# EAGLE design main_c (EAGLE 5.11)
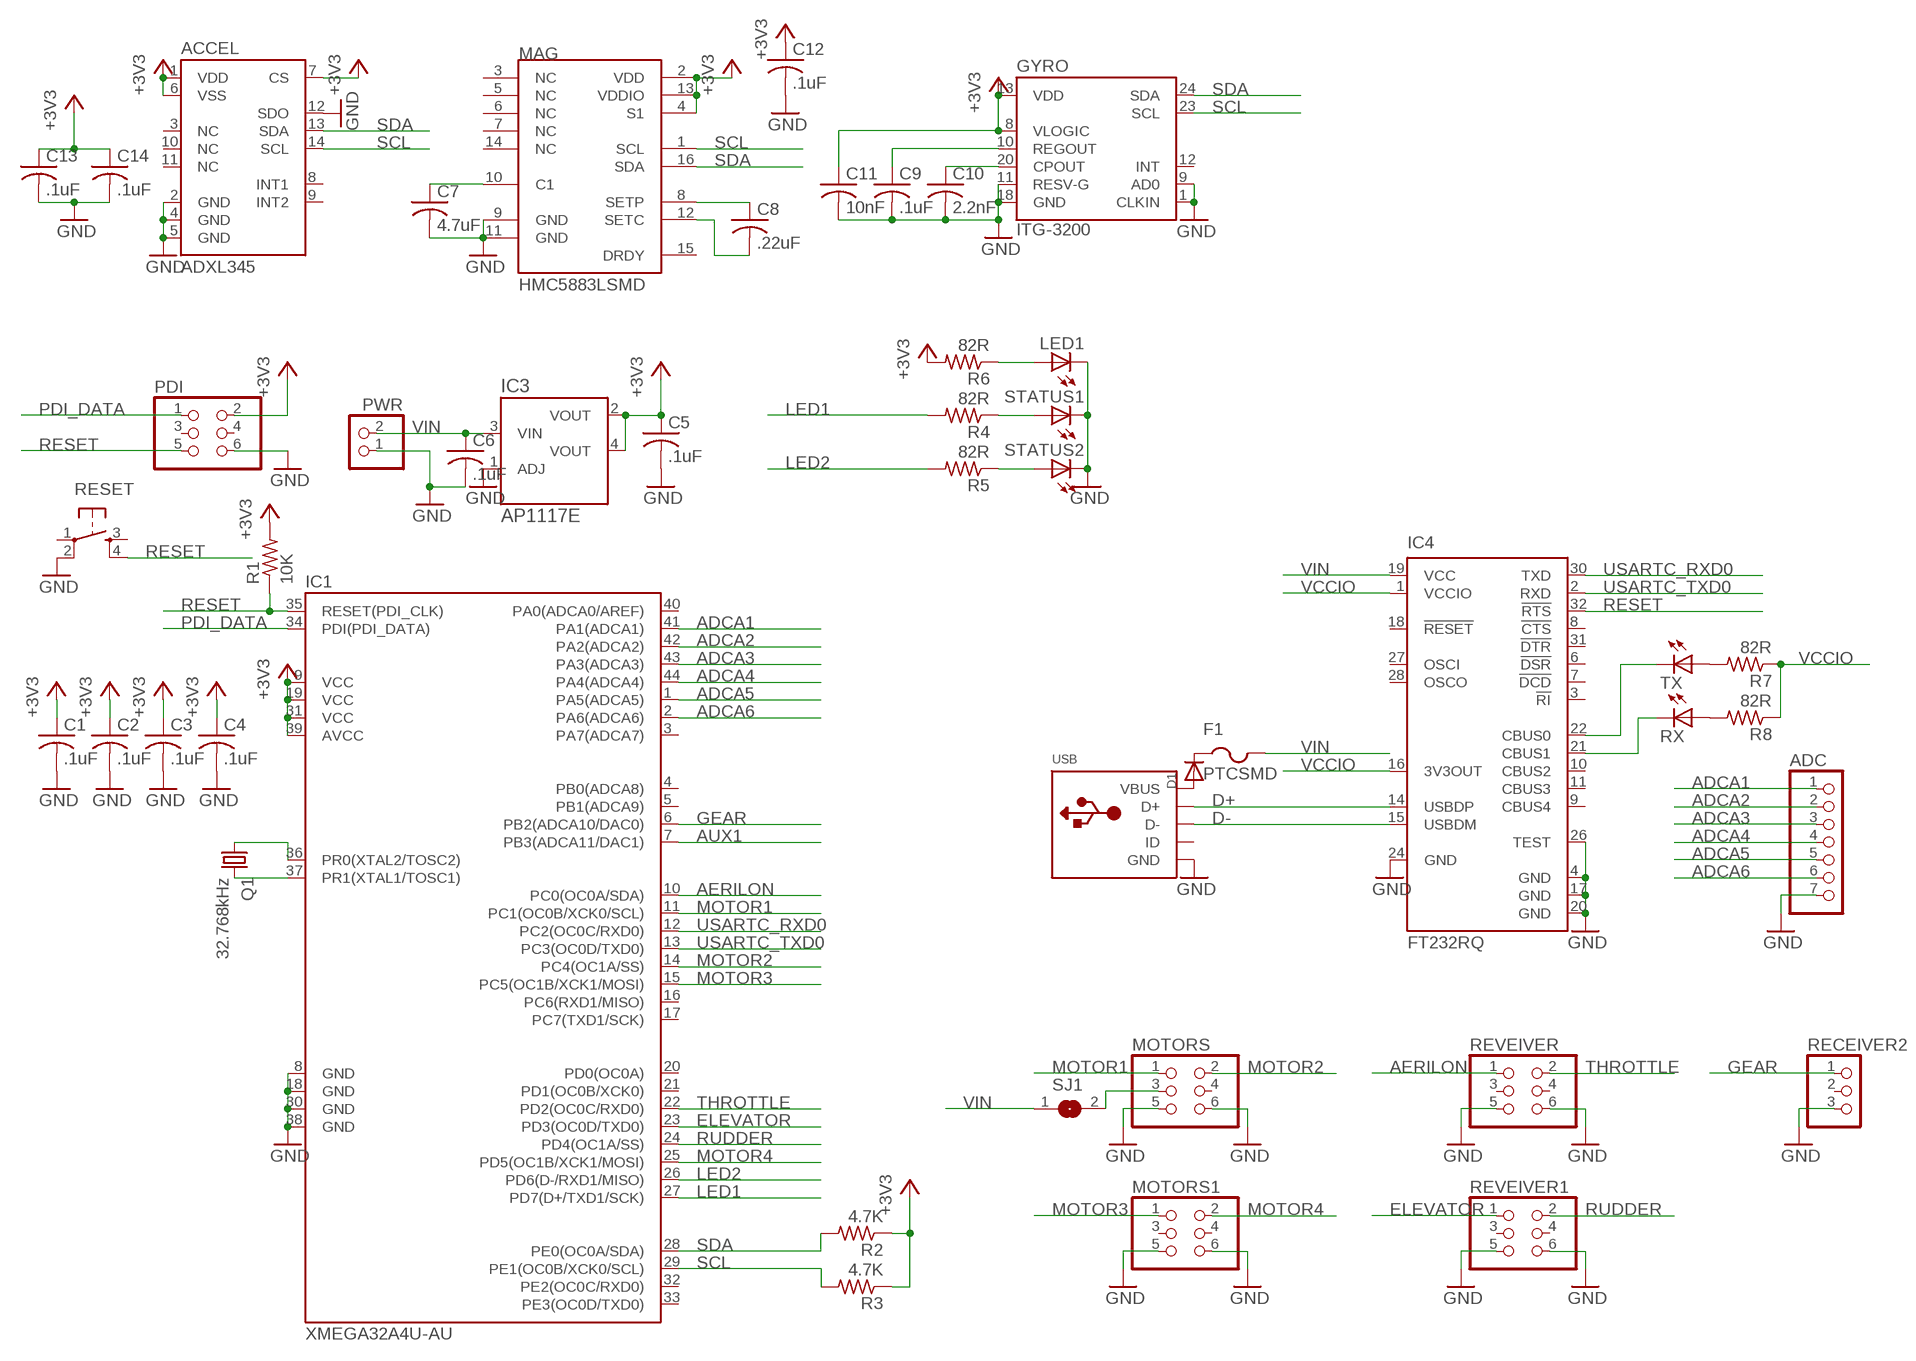
[diagram p0: schematic, sheet 1]

## Parts
ACCEL  ADXL345  [LGA14]
ADC  PINHD-1X7  [1X07]
C1  .1uF  C-USC0603  [C0603]
C2  .1uF  C-USC0603  [C0603]
C3  .1uF  C-USC0603  [C0603]
C4  .1uF  C-USC0603  [C0603]
C5  .1uF  C-USC0603  [C0603]
C6  .1uF  C-USC0603  [C0603]
C7  4.7uF  C-USC0805K  [C0805K]
C8  .22uF  C-USC0603  [C0603]
C9  .1uF  C-USC0603  [C0603]
C10  2.2nF  C-USC0603  [C0603]
C11  10nF  C-USC0603  [C0603]
C12  .1uF  C-USC0603  [C0603]
C13  .1uF  C-USC0603  [C0603]
C14  .1uF  C-USC0603  [C0603]
D1  DIODESOD-123  [SOD-123]
F1  PTCSMD  PTCFUSE-1812  [1812]
GYRO  ITG-3200  [QFN-24]
IC1  XMEGA32A4U-AU  [TQFP44]
IC3  AP1117E  [SOT223-3]
IC4  FT232RQ  [QFN32]
LED1  LEDCHIP-LED0805  [CHIP-LED0805]
MAG  HMC5883LSMD  [16LPCC]
MOTORS  PINHD-2X3  [2X03]
MOTORS1  PINHD-2X3  [2X03]
PDI  PINHD-2X3  [2X03]
PWR  JST_2PIN-THM  [JST-PH-2-THM]
Q1  32.768kHz  CRYSTALTC26V  [TC26V]
R1  10K  R-US_R0603  [R0603]
R2  4.7K  R-US_R0402  [R0402]
R3  4.7K  R-US_R0402  [R0402]
R4  82R  R-US_R0603  [R0603]
R5  82R  R-US_R0603  [R0603]
R6  82R  R-US_R0603  [R0603]
R7  82R  R-US_R0603  [R0603]
R8  82R  R-US_R0603  [R0603]
RECEIVER2  PINHD-1X3  [1X03]
RESET  TAC_SWITCHSMD  [TACTILE_SWITCH_SMD]
REVEIVER  PINHD-2X3  [2X03]
REVEIVER1  PINHD-2X3  [2X03]
RX  LEDCHIP-LED0805  [CHIP-LED0805]
SJ1  SJ  [SJ]
STATUS1  LEDCHIP-LED0805  [CHIP-LED0805]
STATUS2  LEDCHIP-LED0805  [CHIP-LED0805]
TX  LEDCHIP-LED0805  [CHIP-LED0805]
USB  USBMINIB  [USB-MINIB]

## Nets
+3V3: ACCEL.1(VDD) ACCEL.6(VSS) ACCEL.7(CS) C1.1 C2.1 C3.1 C4.1 C5.1 C11.1 C12.1 C13.1 C14.1 GYRO.8(VLOGIC) GYRO.13(VDD) IC1.9(VCC) IC1.19(VCC) IC1.31(VCC) IC1.39(AVCC) IC3.2(VOUT) IC3.4(VOUT) MAG.2(VDD) MAG.4(S1) MAG.13(VDDIO) PDI.2 R1.2 R2.1 R3.1 R6.2
ADCA1: ADC.1 IC1.41(PA1(ADCA1))
ADCA2: ADC.2 IC1.42(PA2(ADCA2))
ADCA3: ADC.3 IC1.43(PA3(ADCA3))
ADCA4: ADC.4 IC1.44(PA4(ADCA4))
ADCA5: ADC.5 IC1.1(PA5(ADCA5))
ADCA6: ADC.6 IC1.2(PA6(ADCA6))
AERILON: IC1.10(PC0(OC0A/SDA)) REVEIVER.1
AUX1: IC1.7(PB3(ADCA11/DAC1))
D+: IC4.14(USBDP) USB.D+
D-: IC4.15(USBDM) USB.D-
ELEVATOR: IC1.23(PD3(OC0D/TXD0)) REVEIVER1.1
GEAR: IC1.6(PB2(ADCA10/DAC0)) RECEIVER2.1
GND: ACCEL.2(GND) ACCEL.4(GND) ACCEL.5(GND) ACCEL.12(SDO) ADC.7 C1.2 C2.2 C3.2 C4.2 C5.2 C6.2 C7.2 C9.2 C10.2 C11.2 C12.2 C13.2 C14.2 GYRO.1(CLKIN) GYRO.9(AD0) GYRO.11(RESV-G) GYRO.18(GND) IC1.8(GND) IC1.18(GND) IC1.30(GND) IC1.38(GND) IC3.1(ADJ) IC4.4(GND) IC4.17(GND) IC4.20(GND) IC4.24(GND) IC4.26(TEST) LED1.C MAG.9(GND) MAG.11(GND) MOTORS1.5 MOTORS1.6 MOTORS.5 MOTORS.6 PDI.6 PWR.1 RECEIVER2.3 RESET.2 REVEIVER1.5 REVEIVER1.6 REVEIVER.5 REVEIVER.6 STATUS1.C STATUS2.C USB.GND
LED1: IC1.27(PD7(D+/TXD1/SCK)) R4.2
LED2: IC1.26(PD6(D-/RXD1/MISO)) R5.2
MOTOR1: IC1.11(PC1(OC0B/XCK0/SCL)) MOTORS.1
MOTOR2: IC1.14(PC4(OC1A/SS)) MOTORS.2
MOTOR3: IC1.15(PC5(OC1B/XCK1/MOSI)) MOTORS1.1
MOTOR4: IC1.25(PD5(OC1B/XCK1/MOSI)) MOTORS1.2
N$1: IC1.36(PR0(XTAL2/TOSC2)) Q1.1
N$2: IC1.37(PR1(XTAL1/TOSC1)) Q1.2
N$3: R4.1 STATUS1.A
N$4: R5.1 STATUS2.A
N$5: C10.1 GYRO.20(CPOUT)
N$6: C7.1 MAG.10(C1)
N$7: C8.1 MAG.8(SETP)
N$8: LED1.A R6.1
N$9: C8.2 MAG.12(SETC)
N$10: C9.1 GYRO.10(REGOUT)
N$11: IC4.22(CBUS0) TX.C
N$12: IC4.21(CBUS1) RX.C
N$13: R7.2 TX.A
N$14: D1.A USB.VBUS
N$15: R8.2 RX.A
N$16: D1.C F1.1
N$17: MOTORS.3 SJ1.2
PDI_DATA: IC1.34(PDI(PDI_DATA)) PDI.1
RESET: IC1.35(RESET(PDI_CLK)) IC4.32(!RTS) PDI.5 R1.1 RESET.4
RUDDER: IC1.24(PD4(OC1A/SS)) REVEIVER1.2
SCL: ACCEL.14(SCL) GYRO.23(SCL) IC1.29(PE1(OC0B/XCK0/SCL)) MAG.1(SCL) R3.2
SDA: ACCEL.13(SDA) GYRO.24(SDA) IC1.28(PE0(OC0A/SDA)) MAG.16(SDA) R2.2
THROTTLE: IC1.22(PD2(OC0C/RXD0)) REVEIVER.2
USARTC_RXD0: IC1.12(PC2(OC0C/RXD0)) IC4.30(TXD)
USARTC_TXD0: IC1.13(PC3(OC0D/TXD0)) IC4.2(RXD)
VCCIO: IC4.1(VCCIO) IC4.16(3V3OUT) R7.1 R8.1
VIN: C6.1 F1.2 IC3.3(VIN) IC4.19(VCC) PWR.2 SJ1.1
Unconnected: ACCEL.3(NC) ACCEL.8(INT1) ACCEL.9(INT2) ACCEL.10(NC) ACCEL.11(NC) GYRO.12(INT) IC1.3(PA7(ADCA7)) IC1.4(PB0(ADCA8)) IC1.5(PB1(ADCA9)) IC1.16(PC6(RXD1/MISO)) IC1.17(PC7(TXD1/SCK)) IC1.20(PD0(OC0A)) IC1.21(PD1(OC0B/XCK0)) IC1.32(PE2(OC0C/RXD0)) IC1.33(PE3(OC0D/TXD0)) IC1.40(PA0(ADCA0/AREF)) IC4.3(!RI) IC4.6(!DSR) IC4.7(!DCD) IC4.8(!CTS) IC4.9(CBUS4) IC4.10(CBUS2) IC4.11(CBUS3) IC4.18(!RESET) IC4.27(OSCI) IC4.28(OSCO) IC4.31(!DTR) MAG.3(NC) MAG.5(NC) MAG.6(NC) MAG.7(NC) MAG.14(NC) MAG.15(DRDY) MOTORS1.3 MOTORS1.4 MOTORS.4 PDI.3 PDI.4 RECEIVER2.2 RESET.1 RESET.3 REVEIVER1.3 REVEIVER1.4 REVEIVER.3 REVEIVER.4 USB.ID

## Library data of the parts
ACCEL = SparkFun:ADXL345
ADC = pinhead:PINHD-1X7: PIN HEADER
C1-C14 = adafruit:C-US: CAPACITOR, American symbol
D1 = adafruit:DIODE: Diode SMADIODE - SMA Surface Mount Package 20V 1A Schottky Diode Digikey: 641-1014-6-ND DO-1N4148 - Through Hole Small Current Diode SOD-123 20V 1 A (.5mV Vf) Schottky Diode - Digikey: MBRX120TPMSCT-ND SOD-323 10V 570mA (.38mV Vf, 3ns) Schottky Diode - Digikey: ZLLS410CT-ND SOD-523 30V 30mA Schottky Diode (RB751S-40TE61) - Digikey: RB751S-40TE61CT-ND SOT23-R/W - SOT23 Package (R = Solder Paste/Reflow Ovens, W = Hand-Soldering) BAT54Film 40V 300mA - Digikey: 497-7162-1-ND
F1 = adafruit:PTCFUSE: PTC fuses, resettable thermistors
GYRO = SparkFun:ITG-3200: ITG-3200 3-axis gyro, digital output, qfn24 package
IC1 = atmel:XMEGA32A4U: 8/16-bit Atmel XMEGA A4U Microcontroller Features High-performance, Low-power 8/16-bit AVR XMEGA Microcontroller Non-Volatile Program and Data Memories - 16 KB - 128 KB of In-System Self-Programmable Flash - 4 KB - 8 KB Boot Code Section with Independent Lock Bits - 1 KB - 2 KB EEPROM - 2 KB - 8 KB Internal SRAM Peripheral Features - Four-channel DMA Controller with support for external requests - Eight-channel Event System - Five 16-bit Timer/Counters Three Timer/Counters with 4 Output Compare or Input Capture channels Two Timer/Counters with 2 Output Compare or Input Capture channels High-Resolution Extensions on all Timer/Counters Advanced Waveform Extension on one Timer/Counter - One USB device interface USB 2.0 full speed (12Mbps) and low speed (1.5Mbps) device compliant 32 Endpoints with full configuration flexibility - Five USARTs IrDA Extension on one USART - Two Two-Wire Interfaces with dual address match (I2C and SMBus compatible) - Two SPIs (Serial Peripheral Interfaces) peripherals - AES and DES Crypto Engine - 16-bit Real Time Counter with Separate Oscillator - One Twelve-channel, 12-bit, 2 Msps Analog to Digital Converter - One Two-channel, 12-bit, 1 Msps Digital to Analog Converter - Two Analog Comparators with Window compare function - External Interrupts on all General Purpose I/O pins - Programmable Watchdog Timer with Separate On-chip Ultra Low Power Oscillator Special Microcontroller Features - Power-on Reset and Programmable Brown-out Detection - Internal and External Clock Options with PLL - Programmable Multi-level Interrupt Controller - Sleep Modes: Idle, Power-down, Standby, Power-save, Extended Standby - Advanced Programming, Test and Debugging Interfaces PDI (Program and Debug Interface) for programming, test and debugging I/O and Packages - 34 Programmable I/O Lines - 44 - lead TQFP - 44 - pad VQFN/QFN - 49 - ball VFBGA Operating Voltage - 1.6 - 3.6V Speed performance - 0 - 12 MHz @ 1.6 - 3.6V - 0 - 32 MHz @ 2.7 - 3.6V
IC3 = Diodes Inc:AP1117: AP1117 1A Low Dropout Positive Adjustable or Fixed-Mode Regualtor Source: AP1117 Datasheet <http://www.diodes.com/datasheets/AP1117.pdf>
IC4 = ftdichip:FT232R: Source: http://www.ftdichip.com/Documents/DataSheets/DS_FT232R_v104.pdf; MPN: FT232RQ; OC_FARNELL: 1146033; OC_NEWARK: 91K9919
LED1 RX STATUS1 STATUS2 TX = adafruit:LED: LED OSRAM: - CHIPLED LG R971, LG N971, LY N971, LG Q971, LY Q971, LO R971, LY R971 LH N974, LH R974 LS Q976, LO Q976, LY Q976 LO Q996 - Hyper CHIPLED LW Q18S LB Q993, LB Q99A, LB R99A - SideLED LS A670, LO A670, LY A670, LG A670, LP A670 LB A673, LV A673, LT A673, LW A673 LH A674 LY A675 LS A676, LA A676, LO A676, LY A676, LW A676 LS A679, LY A679, LG A679 - Hyper Micro SIDELED® LS Y876, LA Y876, LO Y876, LY Y876 LT Y87S - SmartLED LW L88C, LW L88S LB L89C, LB L89S, LG L890 LS L89K, LO L89K, LY L89K LS L896, LA L896, LO L896, LY L896 - TOPLED LS T670, LO T670, LY T670, LG T670, LP T670 LSG T670, LSP T670, LSY T670, LOP T670, LYG T670 LG T671, LOG T671, LSG T671 LB T673, LV T673, LT T673, LW T673 LH T674 LS T676, LA T676, LO T676, LY T676, LB T676, LH T676, LSB T676, LW T676 LB T67C, LV T67C, LT T67C, LS T67K, LO T67K, LY T67K, LW E67C LS E67B, LA E67B, LO E67B, LY E67B, LB E67C, LV E67C, LT E67C LW T67C LS T679, LY T679, LG T679 LS T770, LO T770, LY T770, LG T770, LP T770 LB T773, LV T773, LT T773, LW T773 LH T774 LS E675, LA E675, LY E675, LS T675 LS T776, LA T776, LO T776, LY T776, LB T776 LHGB T686 LT T68C, LB T68C - Hyper Mini TOPLED® LB M676 - Mini TOPLED Santana® LG M470 LS M47K, LO M47K, LY M47K Source: http://www.osram.convergy.de/
MAG = SparkFun:HMC5883L: 3 Axis Digital Compass IC
MOTORS MOTORS1 PDI REVEIVER REVEIVER1 = pinhead:PINHD-2X3: PIN HEADER
PWR = adafruit:JST_2PIN: JST 2-Pin Connectors of various flavors SMT-RA (S2B-PH-SM4) 4UConnector #17311 SMT (B2B-PH-SM4) THM-RA (S2B-PH) THM (B2B-PH)
Q1 = crystal:CRYSTAL: CRYSTAL; OC_FARNELL: unknown; OC_NEWARK: unknown
R1-R8 = adafruit:R-US_: RESISTOR, American symbol
RECEIVER2 = pinhead:PINHD-1X3: PIN HEADER
RESET = SparkFun:TAC_SWITCH: Momentary Switch Button commonly used for reset or general input. Spark Fun Electronics SKU : COM-00097
SJ1 = jumper:SJ: SMD solder JUMPER
USB = icsp:USB: USB Connectors USBMINIB - Surface Mount Female Mini-B USB Connector 4UConnector: 06564 By microbuilder.eu Thru-hole RA Female Mini-B USB Connector 4UConnector: 18732 By ladyada.net

## Board
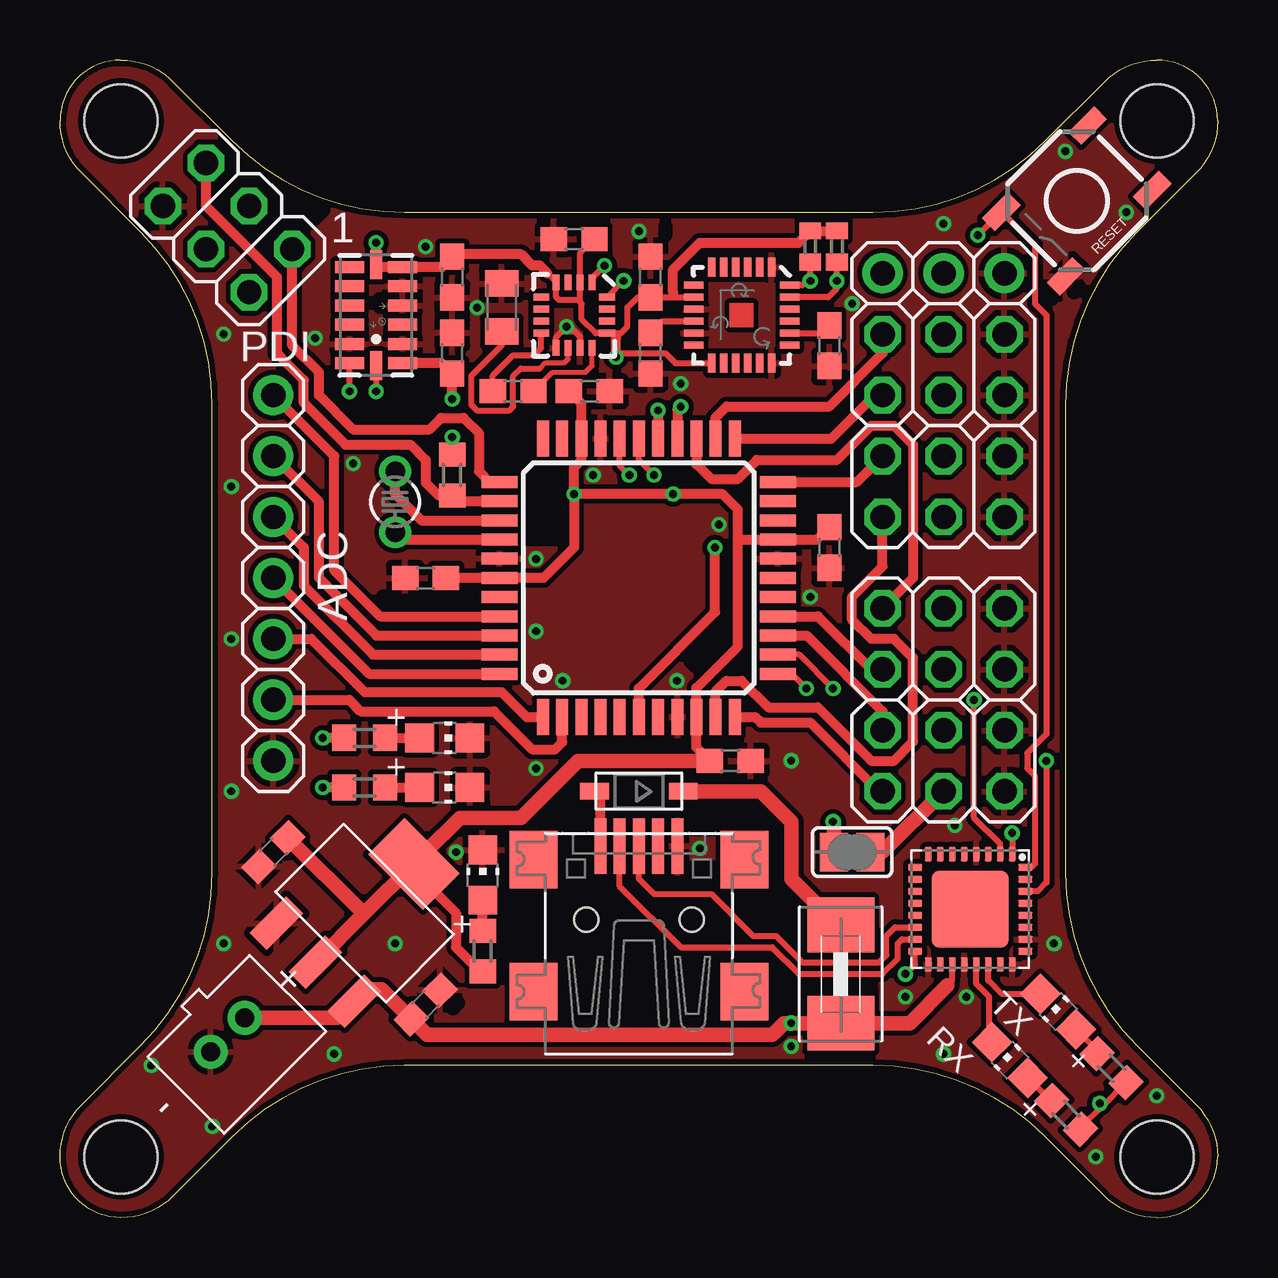
[diagram p1: board, top side]
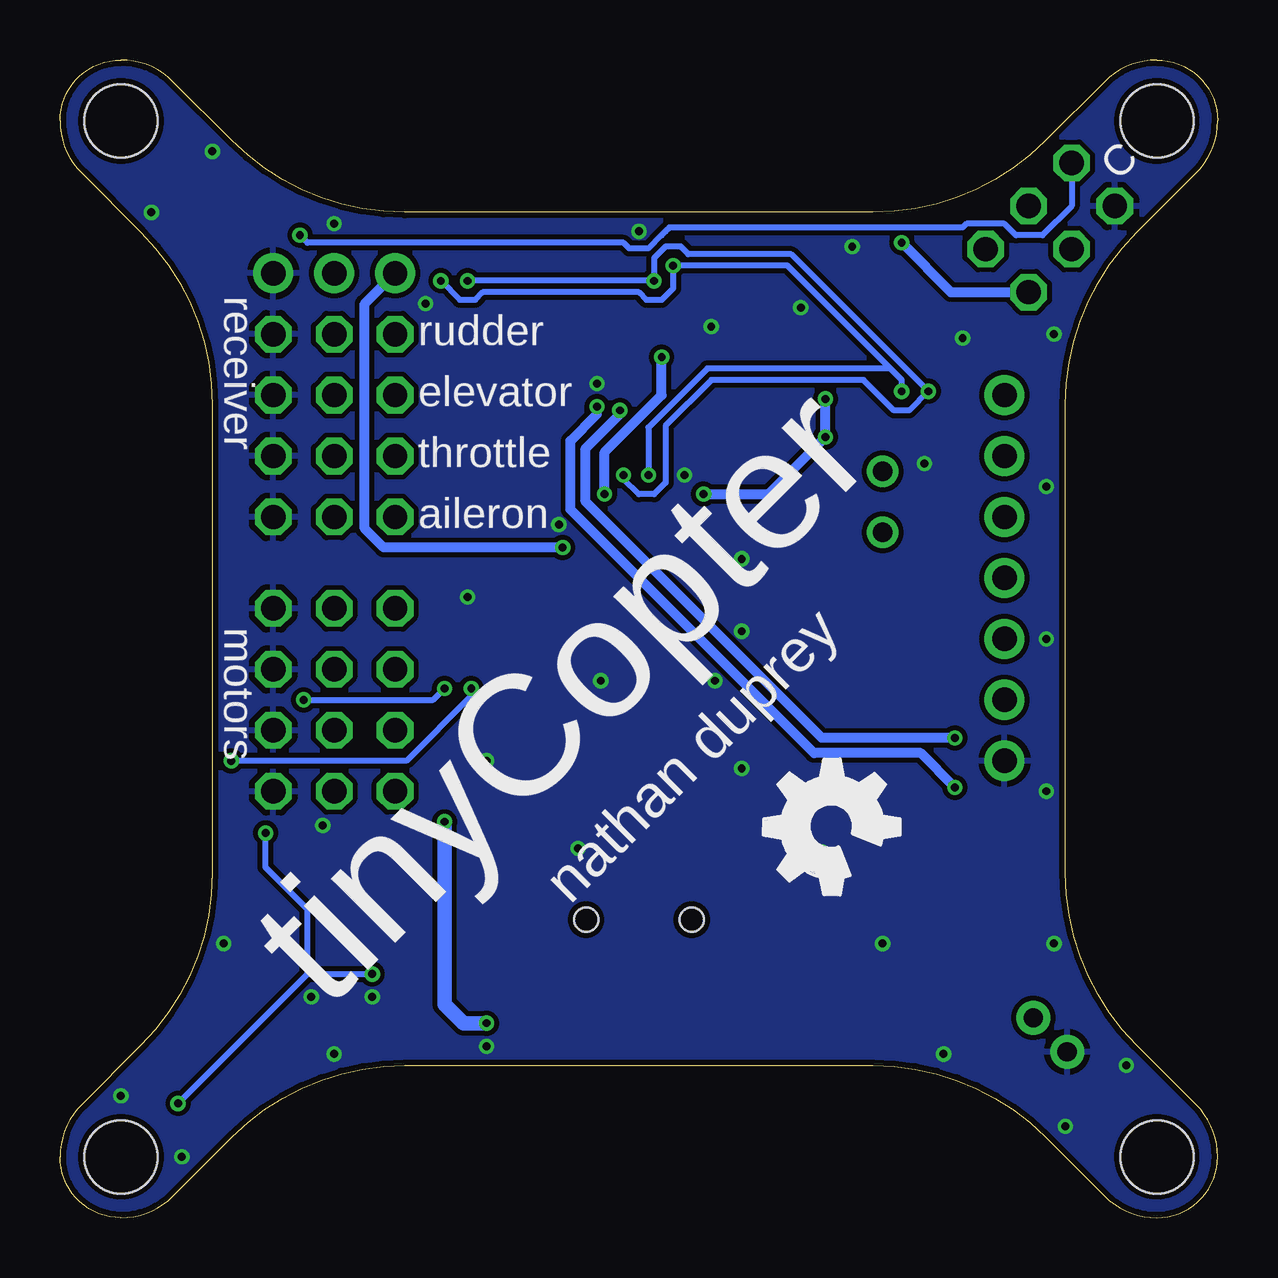
[diagram p2: board, bottom side, seen from below]

Size 48.26 x 48.26 mm. Coordinates in mm from the lower left corner, seen from the top.
Outline: 45.72,0 arc90 48.26,2.54 arc45 47.36,4.71 44.89,7.18 arc-45 41.91,14.37 41.91,33.89 arc-45 44.89,41.08 47.36,43.55 arc45 48.26,45.72 arc90 45.72,48.26 arc45 43.55,47.36 41.08,44.89 arc-45 33.89,41.91 14.37,41.91 arc-45 7.18,44.89 4.71,47.36 arc45 2.54,48.26 arc90 0,45.72 arc45 0.9,43.55 3.37,41.08 arc-45 6.35,33.89 6.35,14.37 arc-45 3.37,7.18 0.9,4.71 arc45 0,2.54 arc90 2.54,0 arc45 4.71,0.9 7.18,3.37 arc-45 14.37,6.35 33.89,6.35 arc-45 41.08,3.37 43.55,0.9 arc45 45.72,0
Copper layers (1*16): Top 0.035mm / dielectric 1.5mm / Bottom 0.035mm
Design rules "ITEADstudio_DRC": minimum track width 6mil, minimum drill 12mil, track to track 6mil, track to pad 6mil, pad to pad 6mil, via to via 6mil, smd to smd 0mil, copper to edge 10mil, drill to drill 10mil, minimum pad ring 10mil, minimum via ring 6mil, stop-mask expansion 2mil, vias tented up to drill 100mil, thermal gap 10mil
Holes 3.05 mm at 2.54,2.54 45.72,2.54 2.54,45.72 45.72,45.72
tRestrict: 23 lines

### Footprints (pad centres in the part's own frame; a part is rotated, then mirrored left to right if it is on the bottom)
LGA14 = smd 0.5 x 1.2: 1 2,1.1; 2 1.2,1.1; 3 0.4,1.1; 4 -0.4,1.1; 5 -1.2,1.1; 6 -2,1.1; 8 -2,-1.1; 9 -1.2,-1.1; 10 -0.4,-1.1; 11 0.4,-1.1; 12 1.2,-1.1; 13 2,-1.1 | smd 1.2 x 0.5: 7 -2.1,0; 14 2.1,0
1X07 = drill 1.016 pad 1.676 round: 1 -7.62,0; 2 -5.08,0; 3 -2.54,0; 4 0,0; 5 2.54,0; 6 5.08,0; 7 7.62,0
C0603 = smd 1.1 x 1: 1 -0.85,0; 2 0.85,0
C0805K = smd 1.1 x 1.4: 1 -1,0; 2 1,0
SOD-123 = smd 1.2 x 0.7: A 1.85,0; C -1.85,0
1812 = smd 2.286 x 2.794: 1 -2.046,0; 2 2.046,0
QFN-24 = smd 0.8 x 0.3: 1 -2,1.25; 2 -2,0.75; 3 -2,0.25; 4 -2,-0.25; 5 -2,-0.75; 6 -2,-1.25; 13 2,-1.25; 14 2,-0.75; 15 2,-0.25; 16 2,0.25; 17 2,0.75; 18 2,1.25 | smd 0.3 x 0.8: 7 -1.25,-2; 8 -0.75,-2; 9 -0.25,-2; 10 0.25,-2; 11 0.75,-2; 12 1.25,-2; 19 1.25,2; 20 0.75,2; 21 0.25,2; 22 -0.25,2; 23 -0.75,2; 24 -1.25,2
TQFP44 = smd 1.5 x 0.5: 1 -5.8,4; 2 -5.8,3.2; 3 -5.8,2.4; 4 -5.8,1.6; 5 -5.8,0.8; 6 -5.8,0; 7 -5.8,-0.8; 8 -5.8,-1.6; 9 -5.8,-2.4; 10 -5.8,-3.2; 11 -5.8,-4; 23 5.8,-4; 24 5.8,-3.2; 25 5.8,-2.4; 26 5.8,-1.6; 27 5.8,-0.8; 28 5.8,0; 29 5.8,0.8; 30 5.8,1.6; 31 5.8,2.4; 32 5.8,3.2; 33 5.8,4 | smd 0.5 x 1.5: 12 -4,-5.8; 13 -3.2,-5.8; 14 -2.4,-5.8; 15 -1.6,-5.8; 16 -0.8,-5.8; 17 0,-5.8; 18 0.8,-5.8; 19 1.6,-5.8; 20 2.4,-5.8; 21 3.2,-5.8; 22 4,-5.8; 34 4,5.8; 35 3.2,5.8; 36 2.4,5.8; 37 1.6,5.8; 38 0.8,5.8; 39 0,5.8; 40 -0.8,5.8; 41 -1.6,5.8; 42 -2.4,5.8; 43 -3.2,5.8; 44 -4,5.8
SOT223-3 = smd 1 x 2.15: 1 -2.3,-2.9; 2 0,-2.9; 3 2.3,-2.9 | smd 3.25 x 2.15: 4 0,2.9
QFN32 = smd 0.6 x 0.3: 1 -2.3,1.75; 2 -2.3,1.25; 3 -2.3,0.75; 4 -2.3,0.25; 5 -2.3,-0.25; 6 -2.3,-0.75; 7 -2.3,-1.25; 8 -2.3,-1.75; 17 2.3,-1.75; 18 2.3,-1.25; 19 2.3,-0.75; 20 2.3,-0.25; 21 2.3,0.25; 22 2.3,0.75; 23 2.3,1.25; 24 2.3,1.75 | smd 0.3 x 0.6: 9 -1.75,-2.3; 10 -1.25,-2.3; 11 -0.75,-2.3; 12 -0.25,-2.3; 13 0.25,-2.3; 14 0.75,-2.3; 15 1.25,-2.3; 16 1.75,-2.3; 25 1.75,2.3; 26 1.25,2.3; 27 0.75,2.3; 28 0.25,2.3; 29 -0.25,2.3; 30 -0.75,2.3; 31 -1.25,2.3; 32 -1.75,2.3 | smd 3.2 x 3.2: EXP 0,0
CHIP-LED0805 = smd 1.2 x 1.2: A 0,-1.05; C 0,1.05
16LPCC = smd 0.65 x 0.28: 1 -1.37,0.75; 2 -1.37,0.25; 3 -1.37,-0.25; 4 -1.37,-0.75; 9 1.37,-0.75; 10 1.37,-0.25; 11 1.37,0.25; 12 1.37,0.75 | smd 0.28 x 0.65: 5 -0.75,-1.37; 6 -0.25,-1.37; 7 0.25,-1.37; 8 0.75,-1.37; 13 0.75,1.37; 14 0.25,1.37; 15 -0.25,1.37; 16 -0.75,1.37
2X03 = drill 1.016 octagon: 1 -2.54,-1.27; 2 -2.54,1.27; 3 0,-1.27; 4 0,1.27; 5 2.54,-1.27; 6 2.54,1.27
JST-PH-2-THM = drill 0.8 pad 1.422 round: 1 1,0; 2 -1,0
TC26V = drill 0.813 round: 1 -1.27,0; 2 1.27,0
R0603 = smd 1 x 1.1: 1 -0.85,0; 2 0.85,0
R0402 = smd 0.7 x 0.9: 1 -0.65,0; 2 0.65,0
1X03 = drill 1.016 pad 1.676 round: 1 -2.54,0; 2 0,0; 3 2.54,0
TACTILE_SWITCH_SMD = smd 1.524 x 0.762: 1 -2.54,1.905; 2 2.54,1.905; 3 -2.54,-1.905; 4 2.54,-1.905
SJ = smd 1.168 x 1.6: 1 -0.762,0; 2 0.762,0
USB-MINIB = smd 0.5 x 2.308: D+ 0,4.064; D- -0.8,4.064; GND 1.6,4.064; ID 0.8,4.064; VBUS -1.6,4.064 | smd 2 x 2.4: GND1 -4.4,-2; GND2 -4.4,3.5; GND3 4.4,3.5; GND4 4.4,-2 | hole 1: -2.2,1; 2.2,1

### Placement (x,y rotation side)
ACCEL  13.18,37.62 270 top
ADC  8.89,26.67 270 top
C1  27.94,19.05 0 top
C2  32.07,27.94 270 top
C3  22.07,34.45 0 top
C4  15.24,26.67 180 top
C5  8.89,15.24 225 top
C6  15.24,8.89 45 top
C7  18.41,37.94 90 top
C8  18.89,34.45 0 top
C9  24.61,36.04 270 top
C10  32.07,36.35 270 top
C11  24.61,39.21 90 top
C12  21.43,40.8 180 top
C13  16.35,39.21 270 top
C14  16.35,36.04 90 top
D1  24.13,17.78 180 top
F1  32.54,10.16 270 top
GYRO  28.42,37.62 270 top
IC1  24.13,26.67 90 top
IC3  12.7,12.7 315 top
IC4  37.94,12.86 270 top
LED1  17.62,14.29 0 top
MAG  21.43,37.62 270 top
MOTORS  36.83,19.05 0 top
MOTORS1  36.83,24.13 0 top
PDI  6.99,41.27 135 top
PWR  6.99,7.62 225 top
Q1  13.97,29.84 270 top
R1  16.35,30.96 90 top
R2  31.27,40.48 270 top
R3  32.38,40.48 270 top
R4  12.7,20 180 top
R5  12.7,17.94 180 top
R6  17.62,11.11 270 top
R7  43.83,6.24 135 top
R8  41.94,4.29 135 top
RECEIVER2  36.83,39.37 0 top
RESET  42.39,42.39 225 top
REVEIVER  36.83,30.48 0 top
REVEIVER1  36.83,35.56 0 top
RX  39.59,6.57 45 top
SJ1  33.02,15.24 0 top
STATUS1  16.03,20 270 top
STATUS2  16.03,17.94 270 top
TX  41.61,8.59 45 top
U$1  [OSHW_FILLX200_NOTEXT]  16.51,12.7 45 bottom
USB  24.13,11.43 0 top

### Tracks (layer width: path | path; a pad name or v marks a point on that pad's centre or on a via)
+3V3  (via drill 0.33)
  Top 0.254: C12.1 21.68,40.2 MAG.2 21.68,38.17 | 21.75,38.1 21.75,37.47 22.34,36.87 MAG.13 23.18,36.87 | 21.75,38.1 21.68,38.17 | 21.75,38.1 | 21.68,38.17 21.59,38.26 20.8,38.26 20.68,38.37 MAG.4 20.68,39.01 20.32,39.37 | 25.56,38.37 24.62,38.37 C11.1 24.07,38.36 23.65,37.94 23.65,37.15 23.38,36.87 23.18,36.87 | 25.56,38.37 GYRO.8 | 25.56,38.37 25.56,38.58 | 23.18,36.67 23.18,36.87 | GYRO.13 25.65,35.62 25.24,36.04 23.34,36.04 v23.18,35.88
  Top 0.406: C13.1 15.91,39.62 ACCEL.6 13.28,39.62 ACCEL.7 v13.18,40.64 | ACCEL.1 15.91,35.62 C14.1 v16.35,34.13 | C2.1 31.55,28.27 IC1.19 28.27,28.27 28.26,28.26 | C1.1 26.53,19.61 IC1.9 26.53,22.09 28.26,23.81 28.26,27.78 28.26,28.26 | C4.1 IC1.39 20.16,26.67 21.43,27.94 v21.43,30.16 | 20.32,39.37 20,39.69 19.68,39.69 19.21,40.16 16.25,40.16 | IC3.4 14.75,14.46 16.51,12.7 16.51,11.27 17.52,10.26 R6.2 | v16.35,32.54 R1.2 | C3.1 21.73,33.94 IC1.31 21.73,31.57 21.43,31.27 v21.43,30.16 | R3.1 R2.1 30.78,40.64 26.67,40.64 25.56,39.53 25.56,38.58 | 28.26,28.26 28.26,29.53 27.62,30.16 v25.56,30.16 v21.43,30.16 | v23.18,35.88 23.18,36.67
  Top 0.61: IC3.2 12.7,12.7 | 12.7,12.7 IC3.4 | C5.1 12.63,12.7 12.7,12.7 | 16.25,40.16 C13.1 | 15.24,15.24 16.67,16.67 19.21,16.67 21.59,19.05 C1.1
  Top 0.813: IC3.4 15.24,15.24
  Bottom 0.406: v16.35,32.54 v16.35,34.13 | PDI.2 11.12,38.58 v13.18,40.64 | v23.18,35.88 23.18,34.29 25.56,31.91 v25.56,30.16 | v16.35,32.54 | v16.35,32.54 18.73,30.16 v21.43,30.16
ADCA1
  Top 0.406: IC1.41 13.35,25.07 11.43,26.99 11.43,31.75 ADC.1
ADCA2
  Top 0.406: IC1.42 13.2,24.27 10.79,26.67 10.79,29.84 ADC.2
ADCA3
  Top 0.406: IC1.43 13.04,23.47 10.16,26.35 10.16,27.94 ADC.3
ADCA4
  Top 0.406: IC1.44 12.89,22.67 ADC.4
ADCA5
  Top 0.406: ADC.5 10.48,24.13 12.7,21.91 18.41,21.91 19.45,20.87 IC1.1
ADCA6
  Top 0.406: ADC.6 12.06,21.59 12.54,21.11 18.1,21.11 19.68,19.53 20.64,19.53 20.93,19.82 IC1.2
AERILON
  Top 0.406: IC1.10 27.33,21.93 27.78,22.38 28.42,22.38 29.53,21.27 31.59,21.27 33.81,19.05 34.77,19.05 35.56,19.84 35.56,23.34 34.77,24.13 33.81,24.13 33.02,24.92 33.02,25.88 34.29,27.15 REVEIVER.1
D+
  Top 0.254: USB.D+ 24.13,14.13 24.77,13.49 27.15,13.49 28.89,11.75 29.84,11.75 30.96,10.64 34.13,10.64 34.45,10.95 34.45,11.75 34.81,12.11 IC4.14
D-
  Top 0.254: USB.D- 23.33,13.82 25.88,11.27 29.69,11.27 30.8,10.16 34.29,10.16 34.92,10.79 34.92,11.43 35.1,11.61 IC4.15
ELEVATOR
  Top 0.406: REVEIVER1.1 33.97,34.29 32.23,32.54 32.15,32.47 IC1.23
GEAR  (via drill 0.33)
  Top 0.406: IC1.6 24.13,22.07 27.3,25.24 v27.3,27.94
  Bottom 0.406: v27.3,27.94 34.77,27.94 35.56,28.73 35.56,38.1 RECEIVER2.1
GND  (via drill 0.33)
  Top 0.254: MAG.9 20.68,36.72 20.95,36.99 21.43,36.99 21.68,36.74 MAG.11
  other vias: 31.27,25.88 43.18,2.54 45.72,5.08 36.83,6.83 41.43,11.43 37.78,9.21 6.35,3.81 3.81,6.35 6.83,11.43 11.43,6.83 6.83,36.83 21.11,37.15 24.13,41.12 36.83,41.43 17.38,37.94 37.31,16.35 41.91,44.45 44.45,41.91 30.48,7.14 35.24,9.21 26.67,15.4 16.51,15.24 22.23,30.96 19.84,27.46 12.22,31.43 27.46,28.89 25.72,22.38 15.24,40.48 10.64,36.67 7.14,17.78 7.14,24.13 7.14,30.48 19.84,18.73 13.97,11.43 30.48,19.05 20.96,22.38 19.84,24.45 25.88,34.77 33.02,38.1
  pour Top (isolate 0.203): 7.18,3.37 arc-45 14.37,6.35 33.89,6.35 arc-45 41.08,3.37 43.55,0.9 arc45 45.72,0 arc90 48.26,2.54 arc45 47.36,4.71 44.89,7.18 arc-45 41.91,14.37 41.91,33.89 arc-45 44.89,41.08 47.36,43.55 arc45 48.26,45.72 arc90 45.72,48.26 arc45 43.55,47.36 41.08,44.89 arc-45 33.89,41.91 14.37,41.91 arc-45 7.18,44.89 4.71,47.36 arc45 2.54,48.26 arc90 0,45.72 arc45 0.9,43.55 3.37,41.08 arc-45 6.35,33.89 6.35,14.37 arc-45 3.37,7.18 0.9,4.71 arc45 0,2.54 arc90 2.54,0 arc45 4.71,0.9
  pour Bottom (isolate 0.203): 7.18,3.37 arc-45 14.37,6.35 33.89,6.35 arc-45 41.08,3.37 43.55,0.9 arc45 45.72,0 arc90 48.26,2.54 arc45 47.36,4.71 44.89,7.18 arc-45 41.91,14.37 41.91,33.89 arc-45 44.89,41.08 47.36,43.55 arc45 48.26,45.72 arc90 45.72,48.26 arc45 43.55,47.36 41.08,44.89 arc-45 33.89,41.91 14.37,41.91 arc-45 7.18,44.89 4.71,47.36 arc45 2.54,48.26 arc90 0,45.72 arc45 0.9,43.55 3.37,41.08 arc-45 6.35,33.89 6.35,14.37 arc-45 3.37,7.18 0.9,4.71 arc45 0,2.54 arc90 2.54,0 arc45 4.71,0.9
LED1  (via drill 0.33)
  Top 0.406: IC1.27 v24.93,33.65 v24.92,33.66 | R4.2 v10.95,20 | v10.95,20
  Bottom 0.406: v24.92,33.66 24.92,33.5 26.19,32.23 | 26.19,32.23 | 26.19,32.23 26.35,32.07 26.35,29.84 16.51,20 v10.95,20
LED2  (via drill 0.33)
  Top 0.406: IC1.26 25.73,33.67 v25.88,33.81 | R5.2 v10.95,17.94
  Bottom 0.406: v25.88,33.81 25.88,33.5 26.99,32.38 26.99,29.53 16.83,19.37 12.38,19.37 v10.95,17.94
MOTOR1
  Top 0.406: IC1.11 28.98,20.87 29.21,20.64 31.27,20.64 34.13,17.78 MOTORS.1
MOTOR2
  Top 0.406: IC1.14 31.13,24.27 34.29,21.11 MOTORS.2
MOTOR3
  Top 0.406: IC1.15 31.6,25.07 33.81,22.86 MOTORS1.1
MOTOR4
  Top 0.406: IC1.25 26.53,31.41 27.15,30.8 28.26,30.8 29.05,31.59 32.38,31.59 33.81,33.02 34.77,33.02 35.56,32.23 35.56,26.67 MOTORS1.2
N$1
  Top 0.406: IC1.36 15.06,29.07 13.97,30.16 Q1.1
N$2
  Top 0.406: IC1.37 14.28,28.27 Q1.2
N$3
  Top 0.406: R4.1 STATUS1.A | STATUS1.A
N$4
  Top 0.406: R5.1 STATUS2.A | STATUS2.A 15.08,17.94 15.24,17.78 15.14,17.78 STATUS2.A
N$5
  Top 0.254: GYRO.20 31.74,36.87 C10.1
N$6
  Top 0.203: MAG.10 21.18,35.79 21.03,35.64 20.24,35.64 20,35.4 | 17.22,33.81
  Top 0.254: 20,35.4 19.21,35.4 18.89,35.08 18.89,33.81 18.73,33.66 17.38,33.66 17.22,33.81 17.14,33.89 17.14,35.08 18.41,36.35 C7.1
N$7
  Top 0.254: MAG.8 20.06,36.25 19.76,35.96 18.89,35.96 18.04,35.11 C8.1
N$8
  Top 0.406: R6.1 LED1.A
N$9
  Top 0.203: MAG.12 22.18,35.52 21.91,35.24 20.54,35.24 C8.2
N$10
  Top 0.254: GYRO.10 25.09,37.37 C9.1
N$11
  Top 0.254: TX.C 39.24,9.33 38.69,9.89 IC4.22
N$12
  Top 0.254: IC4.21 38.19,9.75 38.73,9.21 38.73,7.43 RX.C
N$13
  Top 0.254: R7.2 43.23,6.97 TX.A
N$14
  Top 0.406: USB.VBUS 22.53,17.53 D1.A
N$15
  Top 0.254: R8.2 41.28,4.89 RX.A
N$16
  Top 0.61: D1.C 29.21,17.78 30.48,16.51 30.48,14.13 32.4,12.21 F1.1
N$17
  Top 0.61: SJ1.2 34.29,15.24 MOTORS.3
PDI_DATA
  Top 0.406: IC1.34 17.91,30.67 17.46,31.11 17.46,32.7 16.83,33.34 15.88,33.34 15.4,32.86 12.22,32.86 10.79,34.29 10.79,35.24 9.68,36.36 PDI.1
RESET  (via drill 0.33)
  Top 0.254: IC4.32 40.48,14.61 40.64,14.76 40.64,18.41 40.48,18.57 | 40.48,18.57 | 40.48,18.57 40.32,18.73 40.32,19.37 41.12,20.16 41.12,37.62 40.64,38.1 40.64,40.54 RESET.4 | RESET.4 | v38.26,40.96 RESET.4
  Top 0.406: PDI.5 6.09,42.17 9.05,39.21 9.05,36.04 9.21,35.88 10.16,34.92 10.16,33.97 11.91,32.23 14.61,32.23 15.24,31.59 15.24,30.64 15.77,30.11 R1.1 16.59,29.87 IC1.35
  Bottom 0.254: v38.26,40.96 | 38.1,40.8 v38.26,40.96 | 38.1,40.8 | 38.1,40.8 37.94,40.64 24.77,40.64 24.53,40.4 23.73,40.4 23.18,40.96 | 23.18,40.96 | 23.02,41.12 23.18,40.96 | 23.02,41.12 | 23.02,41.12 22.86,41.27 10.64,41.27 10.48,41.43 8.89,41.43 8.41,40.96 7.3,40.96 6.09,42.17 PDI.5
RUDDER
  Top 0.406: IC1.24 27.33,33.36 27.78,33.81 32.07,33.81 34.29,36.04 REVEIVER1.2
SCL  (via drill 0.33)
  Top 0.254: GYRO.23 32.02,38.37 32.38,38.73 v32.38,39.05 R3.2 | MAG.1 22.18,39.17 v22.7,39.69 | ACCEL.14 v13.18,34.45 | IC1.29 23.33,31.36 v23.73,30.96
  Bottom 0.254: v32.38,39.05 31.59,38.26 30.96,38.26 30.64,38.58 24.13,38.58 23.81,38.26 23.18,38.26 22.7,38.73 v22.7,39.69 17.94,39.69 13.65,35.4 | v13.18,34.45 13.18,34.92 13.65,35.4 | v23.73,30.96 23.73,32.94 21.27,35.4 13.65,35.4
SDA  (via drill 0.33)
  Top 0.254: GYRO.24 30.94,38.87 31.19,39.13 | 31.19,39.13 31.27,39.21 R2.2 | v31.27,39.05 31.19,39.13 | MAG.16 22.82,38.37 v23.5,39.05 | ACCEL.13 12.08,34.46 v12.06,34.45 | IC1.28 24.13,31.59 v24.77,30.96
  Bottom 0.254: v31.27,39.05 v23.5,39.05 23.5,40.01 23.02,40.48 22.38,40.48 22.07,40.16 17.78,40.16 v12.06,34.45 12.86,33.66 13.49,33.66 14.76,34.92 21.11,34.92 23.02,33.02 23.02,30.64 23.5,30.16 24.13,30.16 24.77,30.8 v24.77,30.96
THROTTLE
  Top 0.406: IC1.22 33.21,30.67 REVEIVER.2
USARTC_RXD0  (via drill 0.33)
  Top 0.254: IC1.12 30.51,22.67 v31.11,22.07 | v41.12,19.05 41.12,18.89 41.12,13.97 40.76,13.61 IC4.30
  Top 0.406: v41.12,19.05
  Bottom 0.254: v31.11,22.07 31.11,21.75 33.81,19.05 v41.12,19.05
USARTC_TXD0  (via drill 0.33)
  Top 0.254: IC4.2 39.19,15.58 38.1,16.67 v38.1,21.59 | IC1.13 30.82,23.47 v32.23,22.07
  Bottom 0.254: v38.1,21.59 32.7,21.59 v32.23,22.07
VCCIO  (via drill 0.33)
  Top 0.254: R8.1 42.54,3.74 43.45,4.65 | 43.45,4.65 R7.1 | IC4.16 35.64,10.56 v35.24,10.16 | v43.34,4.76 43.18,4.92 43.45,4.65 | IC4.1 v39.69,16.03
  Bottom 0.254: 37.94,10.16 v35.24,10.16 | v43.34,4.76 37.94,10.16 | v39.69,16.03 39.69,14.61 37.94,12.86 37.94,10.16
VIN  (via drill 0.33)
  Top 0.254: IC4.19 37.19,9.89 36.99,9.68
  Top 0.61: PWR.2 11.58,8.33 IC3.3 12.28,9.1 12.7,9.53 13.4,9.53 C6.1 15.31,7.62 29.69,7.62 29.84,7.78 | F1.2 35.42,8.11 36.99,9.68 | v30.48,8.11 30.18,8.11 29.84,7.78 | v30.48,8.11 F1.2 | 29.84,7.78 | SJ1.1 32.26,16.48 v32.23,16.51 | v30.48,8.11 32.4,8.11 32.54,8.26 F1.2 | F1.2
  Bottom 0.61: v32.23,16.51 32.23,8.89 31.43,8.1 30.5,8.1 v30.48,8.11

### Text on the board
tPlace: 1
bPlace: C | receiver | rudder | elevator | throttle | aileron | motors | nathan duprey | tinyCopter